# EAGLE schematic nucleo (EAGLE 6.6.0)
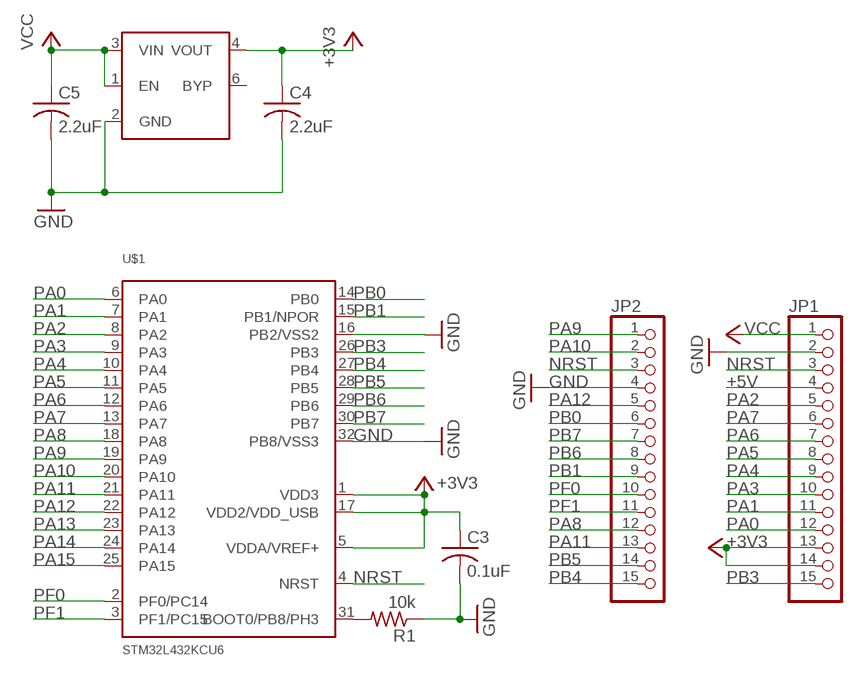
[diagram p0: schematic, sheet 1]

## Parts
C3  0.1uF  C-USC0402  [C0402]
C4  2.2uF  C-USC0402  [C0402]
C5  2.2uF  C-USC0402  [C0402]
JP1  PINHD-1X15  [1X15]
JP2  PINHD-1X15  [1X15]
R1  10k  R-US_R0402  [R0402]
U$1  STM32L432KCU6  [QFN-32]
U$3  MIC5305-MLF  [MLF-6]

## Nets
+3V3: C3.1 C4.1 JP1.13 JP1.14 U$1.1(VDD3) U$1.5(VDDA/VREF+) U$1.17(VDD2/VDD_USB) U$3.4(VOUT)
+5V: JP1.4
GND: C3.2 C4.2 C5.2 JP1.2 JP2.4 R1.1 U$1.16(PB2/VSS2) U$1.32(PB8/VSS3) U$3.2(GND)
N$1: R1.2 U$1.31(BOOT0/PB8/PH3)
NRST: JP1.3 JP2.3 U$1.4(NRST)
PA0: JP1.12 U$1.6(PA0)
PA1: JP1.11 U$1.7(PA1)
PA2: JP1.5 U$1.8(PA2)
PA3: JP1.10 U$1.9(PA3)
PA4: JP1.9 U$1.10(PA4)
PA5: JP1.8 U$1.11(PA5)
PA6: JP1.7 U$1.12(PA6)
PA7: JP1.6 U$1.13(PA7)
PA8: JP2.12 U$1.18(PA8)
PA9: JP2.1 U$1.19(PA9)
PA10: JP2.2 U$1.20(PA10)
PA11: JP2.13 U$1.21(PA11)
PA12: JP2.5 U$1.22(PA12)
PA13: U$1.23(PA13)
PA14: U$1.24(PA14)
PA15: U$1.25(PA15)
PB0: JP2.6 U$1.14(PB0)
PB1: JP2.9 U$1.15(PB1/NPOR)
PB3: JP1.15 U$1.26(PB3)
PB4: JP2.15 U$1.27(PB4)
PB5: JP2.14 U$1.28(PB5)
PB6: JP2.8 U$1.29(PB6)
PB7: JP2.7 U$1.30(PB7)
PF0: JP2.10 U$1.2(PF0/PC14)
PF1: JP2.11 U$1.3(PF1/PC15)
VCC: C5.1 JP1.1 U$3.1(EN) U$3.3(VIN)
Unconnected: U$3.6(BYP)

## Library data of the parts
C3-C5 = rcl:C-US: CAPACITOR, American symbol
JP1 JP2 = pinhead:PINHD-1X15: PIN HEADER
R1 = rcl:R-US_: RESISTOR, American symbol
U$1 = modular_robotics:STM32L432KCU6
U$3 = modular_robotics:MIC5305